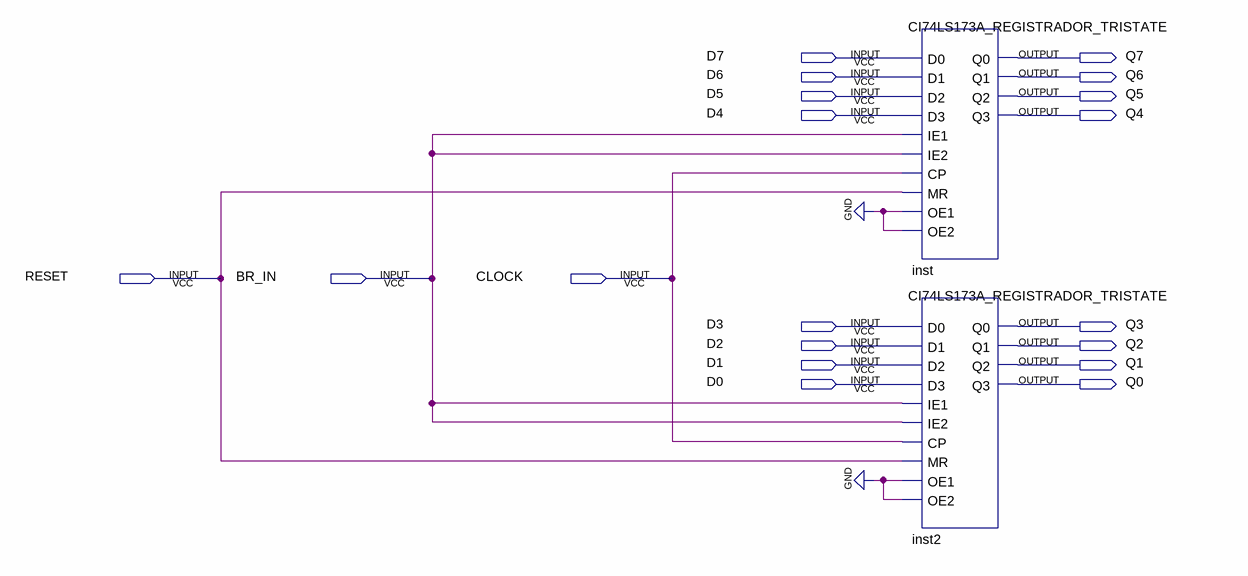
[diagram p0: schematic sheet]
// Quartus schematic Registrador_B.bdf as structural Verilog: 2 symbols, 19 pins
module Registrador_B (
  input  D7,
  input  D6,
  input  D5,
  input  D4,
  input  RESET,
  input  BR_IN,
  input  CLOCK,
  input  D3,
  input  D2,
  input  D1,
  input  D0,
  output Q7,
  output Q6,
  output Q5,
  output Q4,
  output Q3,
  output Q2,
  output Q1,
  output Q0
);

  CI74LS173A_REGISTRADOR_TRISTATE inst (
    .D0(D7), .D1(D6), .D2(D5), .D3(D4), .IE1(BR_IN), .IE2(BR_IN), .CP(CLOCK), .MR(RESET), .OE1(1'b0),
    .OE2(1'b0), .Q2(Q5), .Q1(Q6), .Q3(Q4), .Q0(Q7));
  CI74LS173A_REGISTRADOR_TRISTATE inst2 (
    .D0(D3), .D1(D2), .D2(D1), .D3(D0), .IE1(BR_IN), .IE2(BR_IN), .CP(CLOCK), .MR(RESET), .OE1(1'b0),
    .OE2(1'b0), .Q2(Q1), .Q1(Q2), .Q3(Q0), .Q0(Q3));
endmodule
